# EAGLE design RoPE V3.0 Rev. 00 (EAGLE 9.4.2)
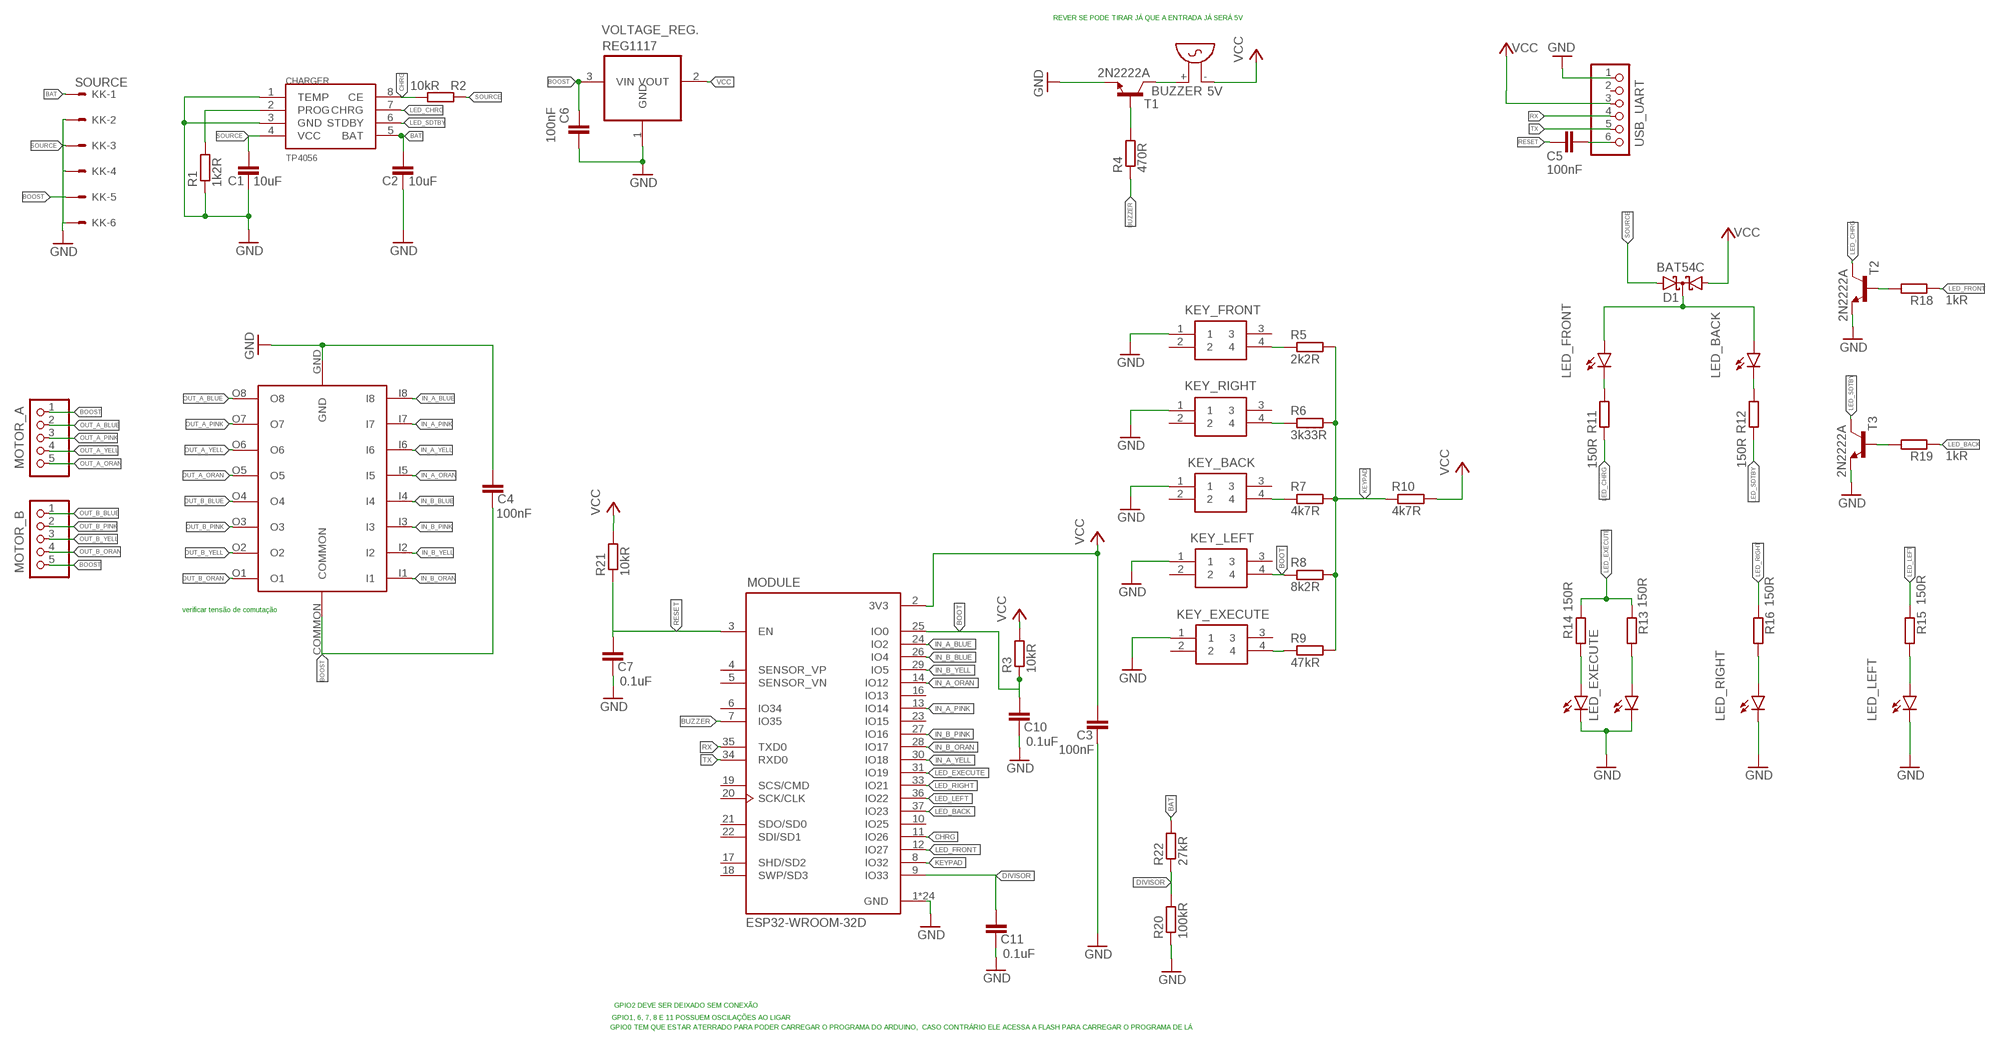
[diagram p0: schematic, sheet 1]

## Parts
BUZZER  5V  F/QMX  [F/QMX]
C1  10uF  C-EUC1210  [C1210]
C2  10uF  C-EUC1210  [C1210]
C3  100nF  C-EUC1210  [C1210]
C4  100nF  C-EUC1210  [C1210]
C5  100nF  C-EUC1210  [C1210]
C6  100nF  C-EUC1210  [C1210]
C7  0.1uF  C-EUC1210  [C1210]
C10  0.1uF  C-EUC1210  [C1210]
C11  0.1uF  C-EUC1210  [C1210]
CHARGER  TP4056  [SOP-8]
D1  BAT54C  [SOT23]
DRIVER  ULN2803AFWG  [ULN2803AFWG]
KEY_BACK  B3F-4050  [B3F-4000]
KEY_EXECUTE  B3F-4050  [B3F-4000]
KEY_FRONT  B3F-4050  [B3F-4000]
KEY_LEFT  B3F-4050  [B3F-4000]
KEY_RIGHT  B3F-4050  [B3F-4000]
KK  SOURCE  22-05-7068-06  [7395-06]
LED_BACK  ORANGE  LEDKA-3528ASYC  [KA-3528ASYC]
LED_EXECUTE  GREEN  LEDKA-3528ASYC  [KA-3528ASYC]
LED_EXECUTE2  GREEN  LEDKA-3528ASYC  [KA-3528ASYC]
LED_FRONT  BLUE  LEDKA-3528ASYC  [KA-3528ASYC]
LED_LEFT  RED  LEDKA-3528ASYC  [KA-3528ASYC]
LED_RIGHT  RED  LEDKA-3528ASYC  [KA-3528ASYC]
MODULE  ESP32-WROOM-32D  [MODULE_ESP32-WROOM-32D]
MOTOR_A  PINHD-1X5/90  [1X05/90]
MOTOR_B  PINHD-1X5/90  [1X05/90]
R1  1k2R  R-EU_R1206W  [R1206W]
R2  10kR  R-EU_R1206W  [R1206W]
R3  10kR  R-EU_R1206W  [R1206W]
R4  470R  R-EU_R1206W  [R1206W]
R5  2k2R  R-EU_R1206W  [R1206W]
R6  3k33R  R-EU_R1206W  [R1206W]
R7  4k7R  R-EU_R1206W  [R1206W]
R8  8k2R  R-EU_R1206W  [R1206W]
R9  47kR  R-EU_R1206W  [R1206W]
R10  4k7R  R-EU_R1206W  [R1206W]
R11  150R  R-EU_R1206W  [R1206W]
R12  150R  R-EU_R1206W  [R1206W]
R13  150R  R-EU_R1206W  [R1206W]
R14  150R  R-EU_R1206W  [R1206W]
R15  150R  R-EU_R1206W  [R1206W]
R16  150R  R-EU_R1206W  [R1206W]
R18  1kR  R-EU_R1206W  [R1206W]
R19  1kR  R-EU_R1206W  [R1206W]
R20  100kR  R-EU_R1206W  [R1206W]
R21  10kR  R-EU_R1206W  [R1206W]
R22  27kR  R-EU_R1206W  [R1206W]
T1  2N2222A  MMBT2222ALT1-NPN-SOT23-BEC  [SOT23-BEC]
T2  2N2222A  MMBT2222ALT1-NPN-SOT23-BEC  [SOT23-BEC]
T3  2N2222A  MMBT2222ALT1-NPN-SOT23-BEC  [SOT23-BEC]
USB_UART  PINHD-1X6/90  [1X06/90]
VOLTAGE_REG.  REG1117  [SOT223]

## Nets
BAT: C2.2 CHARGER.5(BAT) KK.1 R22.2
BOOST: C4.1 C6.2 DRIVER.COMMON KK.5 MOTOR_A.1 MOTOR_B.5 VOLTAGE_REG..3(VIN)
BOOT: C10.2 KEY_LEFT.4 MODULE.25(IO0) R3.1 R8.1
BUZZER: MODULE.7(IO35) R4.1
CHRG: CHARGER.8(CE) MODULE.11(IO26) R2.2
DIVISOR: C11.2 MODULE.9(IO33) R20.2 R22.1
GND: C1.1 C2.1 C3.1 C4.2 C6.1 C7.1 C10.1 C11.1 CHARGER.1(TEMP) CHARGER.3(GND) DRIVER.GND KEY_BACK.1 KEY_EXECUTE.1 KEY_FRONT.1 KEY_LEFT.1 KEY_RIGHT.1 KK.2 KK.4 KK.6 LED_EXECUTE2.C LED_EXECUTE.C LED_LEFT.C LED_RIGHT.C MODULE.1(GND) MODULE.15(GND) MODULE.38(GND) MODULE.39_1(GND) MODULE.39_2(GND) MODULE.39_3(GND) MODULE.39_4(GND) MODULE.39_5(GND) MODULE.39_6(GND) MODULE.39_7(GND) MODULE.39_8(GND) MODULE.39_9(GND) MODULE.39_10(GND) MODULE.39_11(GND) MODULE.39_12(GND) MODULE.39_13(GND) MODULE.39_14(GND) MODULE.39_15(GND) MODULE.39_16(GND) MODULE.39_17(GND) MODULE.39_18(GND) MODULE.39_19(GND) MODULE.39_20(GND) MODULE.39_21(GND) R1.1 R20.1 T1.E T2.E T3.E USB_UART.1 VOLTAGE_REG..1(GND)
IN_A_BLUE: DRIVER.I8 MODULE.24(IO2)
IN_A_ORAN: DRIVER.I5 MODULE.14(IO12)
IN_A_PINK: DRIVER.I7 MODULE.13(IO14)
IN_A_YELL: DRIVER.I6 MODULE.30(IO18)
IN_B_BLUE: DRIVER.I4 MODULE.26(IO4)
IN_B_ORAN: DRIVER.I1 MODULE.28(IO17)
IN_B_PINK: DRIVER.I3 MODULE.27(IO16)
IN_B_YELL: DRIVER.I2 MODULE.29(IO5)
KEYPAD: MODULE.8(IO32) R5.2 R6.2 R7.2 R8.2 R9.2 R10.1
LED_BACK: MODULE.37(IO23) R19.1
LED_CHRG: CHARGER.7(CHRG) R11.1 T2.C
LED_EXECUTE: MODULE.31(IO19) R13.1 R14.1
LED_FRONT: MODULE.12(IO27) R18.1
LED_LEFT: MODULE.36(IO22) R15.1
LED_RIGHT: MODULE.33(IO21) R16.1
LED_SDTBY: CHARGER.6(STDBY) R12.1 T3.C
N$4: C5.1 USB_UART.6
N$5: KEY_RIGHT.4 R6.1
N$6: LED_BACK.C R12.2
N$7: KEY_FRONT.4 R5.1
N$8: BUZZER.+ T1.C
N$9: R4.2 T1.B
N$10: LED_FRONT.C R11.2
N$12: LED_EXECUTE.A R13.2
N$13: LED_EXECUTE2.A R14.2
N$14: LED_RIGHT.A R16.2
N$15: LED_LEFT.A R15.2
N$16: CHARGER.2(PROG) R1.2
N$17: KEY_BACK.4 R7.1
N$18: R19.2 T3.B
N$19: R18.2 T2.B
N$20: D1.3(CC) LED_BACK.A LED_FRONT.A
N$22: KEY_EXECUTE.4 R9.1
OUT_A_BLUE: DRIVER.O8 MOTOR_A.2
OUT_A_ORAN: DRIVER.O5 MOTOR_A.5
OUT_A_PINK: DRIVER.O7 MOTOR_A.3
OUT_A_YELL: DRIVER.O6 MOTOR_A.4
OUT_B_BLUE: DRIVER.O4 MOTOR_B.1
OUT_B_ORAN: DRIVER.O1 MOTOR_B.4
OUT_B_PINK: DRIVER.O3 MOTOR_B.2
OUT_B_YELL: DRIVER.O2 MOTOR_B.3
RESET: C5.2 C7.2 MODULE.3(EN) R21.1
RX: MODULE.35(TXD0) USB_UART.4
SOURCE: C1.2 CHARGER.4(VCC) D1.2(A2) KK.3 R2.1
TX: MODULE.34(RXD0) USB_UART.5
VCC: BUZZER.- C3.2 D1.1(A1) MODULE.2(3V3) R3.2 R10.2 R21.2 USB_UART.3 VOLTAGE_REG..2(VOUT)
Unconnected: KEY_BACK.2 KEY_BACK.3 KEY_EXECUTE.2 KEY_EXECUTE.3 KEY_FRONT.2 KEY_FRONT.3 KEY_LEFT.2 KEY_LEFT.3 KEY_RIGHT.2 KEY_RIGHT.3 MODULE.4(SENSOR_VP) MODULE.5(SENSOR_VN) MODULE.6(IO34) MODULE.10(IO25) MODULE.16(IO13) MODULE.17(SHD/SD2) MODULE.18(SWP/SD3) MODULE.19(SCS/CMD) MODULE.20(SCK/CLK) MODULE.21(SDO/SD0) MODULE.22(SDI/SD1) MODULE.23(IO15) USB_UART.2

## Notes on the sheet
- REVER SE PODE TIRAR JÁ QUE A ENTRADA JÁ SERÁ 5V
- verificar tensão de comutação
- GPIO2 DEVE SER DEIXADO SEM CONEXÃO
- GPIO1, 6, 7, 8 E 11 POSSUEM OSCILAÇÕES AO LIGAR
- GPIO0 TEM QUE ESTAR ATERRADO PARA PODER CARREGAR O PROGRAMA DO ARDUINO,  CASO CONTRÁRIO ELE ACESSA A FLASH PARA CARREGAR O PROGRAMA DE LÁ

## Library data of the parts
BUZZER = buzzer:F/QMX: BUZZER Source: Buerklin; OC_FARNELL: unknown; OC_NEWARK: unknown
C1-C7 C10 C11 = rcl:C-EU: CAPACITOR, European symbol; SPICEPREFIX: C
CHARGER = TP4056:TP4056
D1 = diode:BAT54C: Schottky Diodes Source: Fairchild .. BAT54.pdf
DRIVER = ULN2803AFWG:ULN2803AFWG; AVAILABILITY: Unavailable; DESCRIPTION: Ic Darl Trans Array Hv 18-Sol - Uln2803afwg_o, El, m; MF: Toshiba Semiconductor; MP: ULN2803AFWG; PACKAGE: SOIC-18 Toshiba; PRICE: None
KEY_BACK KEY_EXECUTE KEY_FRONT KEY_LEFT KEY_RIGHT = B3F-4050:B3F-4050: lvory Plunger Tactile Switch, SPST-NO 0.05 A@ 24 V dc 3mm Source: Datasheet <https://www.omron.com/ecb/products/pdf/en-b3f.pdf>; DESCRIPTION: lvory Plunger Tactile Switch, SPST-NO 0.05 A@ 24 V dc 3mm; HEIGHT: mm; MANUFACTURER_NAME: Omron Electronics; MANUFACTURER_PART_NUMBER: B3F-4050; MOUSER_PART_NUMBER: 653-B3F-4050; MOUSER_PRICE-STOCK: https://www.mouser.com/Search/Refine.aspx?Keyword=653-B3F-4050; RS_PART_NUMBER: 6866768P; RS_PRICE-STOCK: http://uk.rs-online.com/web/p/products/6866768P
KK = EP_molex_6410_7395:22-?-06: CONNECTOR wire to board 2.54 mm (.1 inch) pitch header
LED_BACK LED_EXECUTE LED_EXECUTE2 LED_FRONT LED_LEFT LED_RIGHT = led:LED: LED OSRAM: - CHIPLED LG R971, LG N971, LY N971, LG Q971, LY Q971, LO R971, LY R971 LH N974, LH R974 LS Q976, LO Q976, LY Q976 LO Q996 - Hyper CHIPLED LW Q18S LB Q993, LB Q99A, LB R99A - SideLED LS A670, LO A670, LY A670, LG A670, LP A670 LB A673, LV A673, LT A673, LW A673 LH A674 LY A675 LS A676, LA A676, LO A676, LY A676, LW A676 LS A679, LY A679, LG A679 - Hyper Micro SIDELED® LS Y876, LA Y876, LO Y876, LY Y876 LT Y87S - SmartLED LW L88C, LW L88S LB L89C, LB L89S, LG L890 LS L89K, LO L89K, LY L89K LS L896, LA L896, LO L896, LY L896 - TOPLED LS T670, LO T670, LY T670, LG T670, LP T670 LSG T670, LSP T670, LSY T670, LOP T670, LYG T670 LG T671, LOG T671, LSG T671 LB T673, LV T673, LT T673, LW T673 LH T674 LS T676, LA T676, LO T676, LY T676, LB T676, LH T676, LSB T676, LW T676 LB T67C, LV T67C, LT T67C, LS T67K, LO T67K, LY T67K, LW E67C LS E67B, LA E67B, LO E67B, LY E67B, LB E67C, LV E67C, LT E67C LW T67C LS T679, LY T679, LG T679 LS T770, LO T770, LY T770, LG T770, LP T770 LB T773, LV T773, LT T773, LW T773 LH T774 LS E675, LA E675, LY E675, LS T675 LS T776, LA T776, LO T776, LY T776, LB T776 LHGB T686 LT T68C, LB T68C - Hyper Mini TOPLED® LB M676 - Mini TOPLED Santana® LG M470 LS M47K, LO M47K, LY M47K Source: http://www.osram.convergy.de LUXEON: - LUMILED® LXK2-PW12-R00, LXK2-PW12-S00, LXK2-PW14-U00, LXK2-PW14-V00 LXK2-PM12-R00, LXK2-PM12-S00, LXK2-PM14-U00 LXK2-PE12-Q00, LXK2-PE12-R00, LXK2-PE12-S00, LXK2-PE14-T00, LXK2-PE14-U00 LXK2-PB12-K00, LXK2-PB12-L00, LXK2-PB12-M00, LXK2-PB14-N00, LXK2-PB14-P00, LXK2-PB14-Q00 LXK2-PR12-L00, LXK2-PR12-M00, LXK2-PR14-Q00, LXK2-PR14-R00 LXK2-PD12-Q00, LXK2-PD12-R00, LXK2-PD12-S00 LXK2-PH12-R00, LXK2-PH12-S00 LXK2-PL12-P00, LXK2-PL12-Q00, LXK2-PL12-R00 Source: www.luxeon.com KINGBRIGHT: KA-3528ASYC Source: www.kingbright.com
MODULE = ESP32-WROOM-32D:ESP32-WROOM-32D: Bluetooth, WiFi 802.11b/g/n, Bluetooth v4.2 + EDR, Class 1, 2 and 3 Transceiver Module 2.4GHz ~ 2.5GHz Integrated, Trace Surface Mount Buy Part <https://snapeda.com/parts/ESP32-WROOM-32D/Espressif%20Systems/view-part/?ref=eda>; AVAILABILITY: Warning; DESCRIPTION: Bluetooth, WiFi 802.11b/g/n, Bluetooth v4.2 +EDR, Class 1, 2 and 3 Transceiver Module 2.4GHz ~ 2.5GHz Integrated, Trace Surface Mount; DIGIKEY-PURCHASE-URL: https://snapeda.com/shop?store=DigiKey&id=2768115; MF: Espressif Systems; MP: ESP32-WROOM-32D; PACKAGE: Module Espressif Systems; PRICE: None
MOTOR_A MOTOR_B = pinhead:PINHD-1X5: PIN HEADER
R1-R16 R18-R22 = rcl:R-EU_: RESISTOR, European symbol; SPICEPREFIX: R
T1-T3 = transistor:*-NPN-: NPN Transistror BF959 corrected 2008.03.06
USB_UART = pinhead:PINHD-1X6: PIN HEADER
VOLTAGE_REG. = burr-brown:REG1117: 800mA and 1A Low Dropout (LDO) Positive Regulator 1.8V, 2.5V, 2.85V, 3.3V, 5V, and Adj; MPN: REG1117; OC_FARNELL: 1097566; OC_NEWARK: 14P6981

## Board
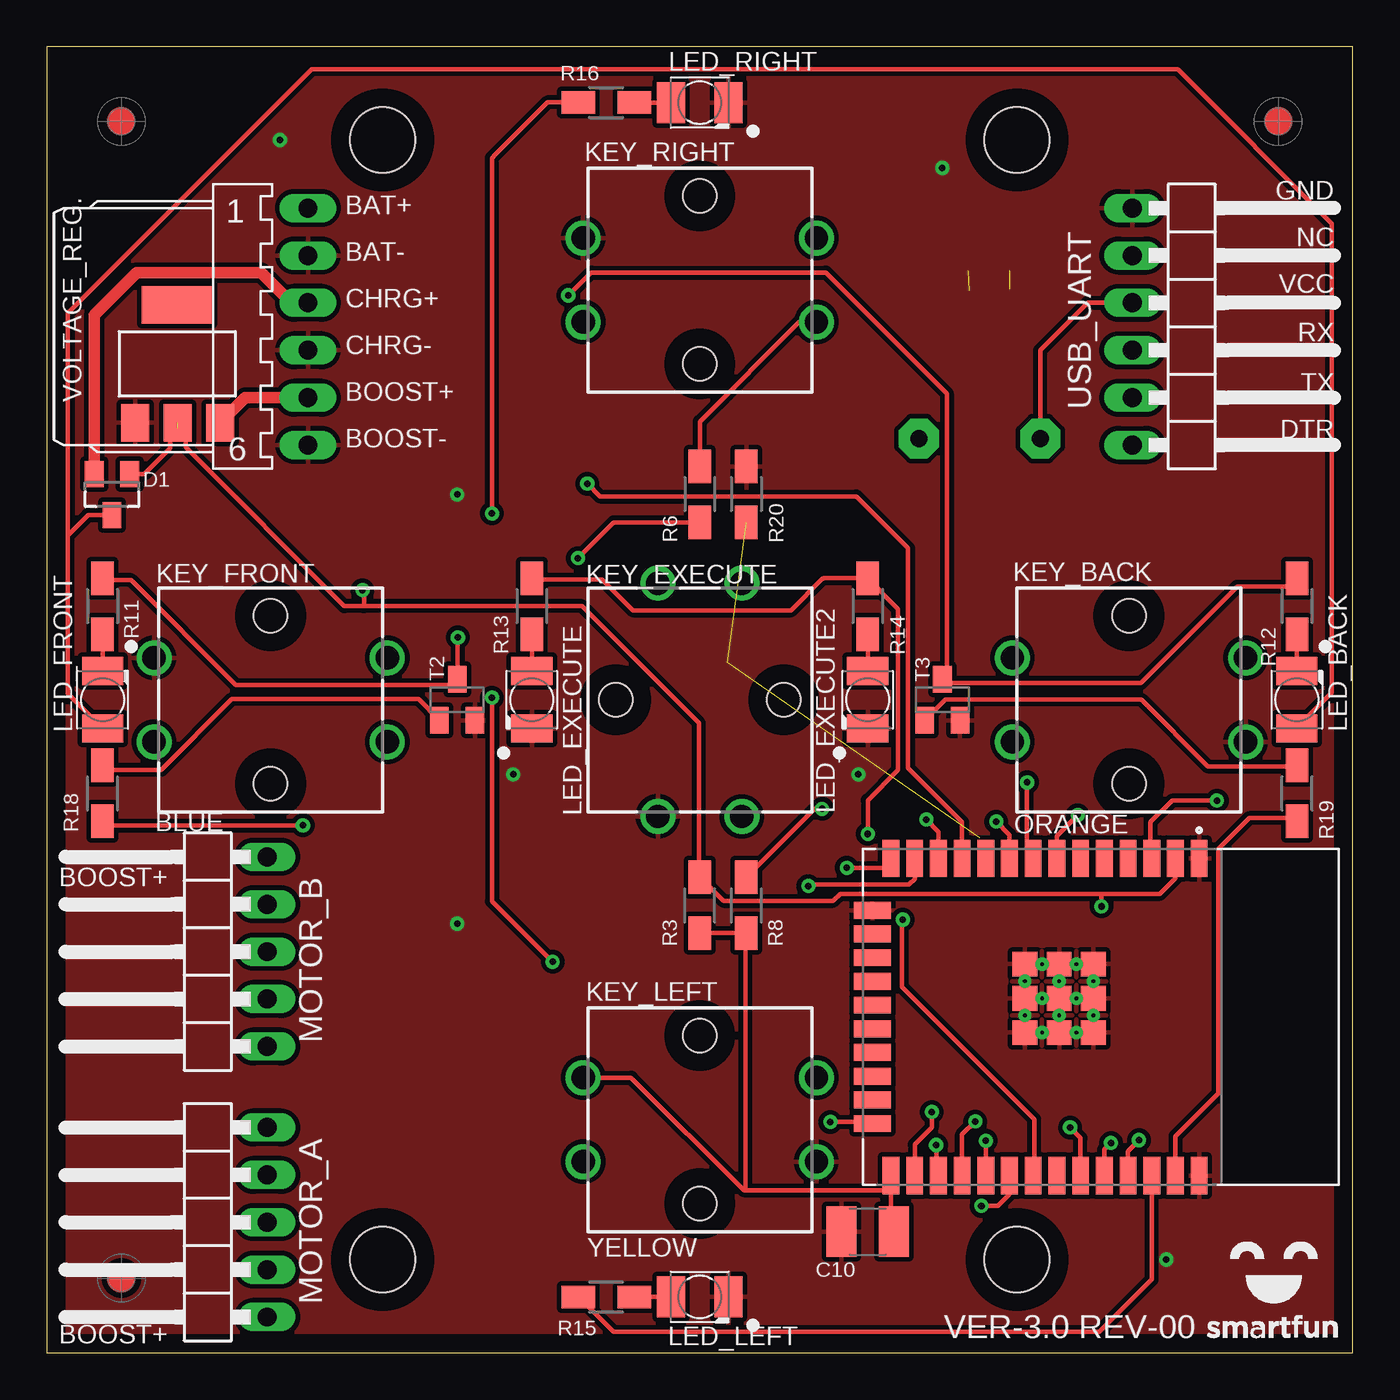
[diagram p1: board, top side]
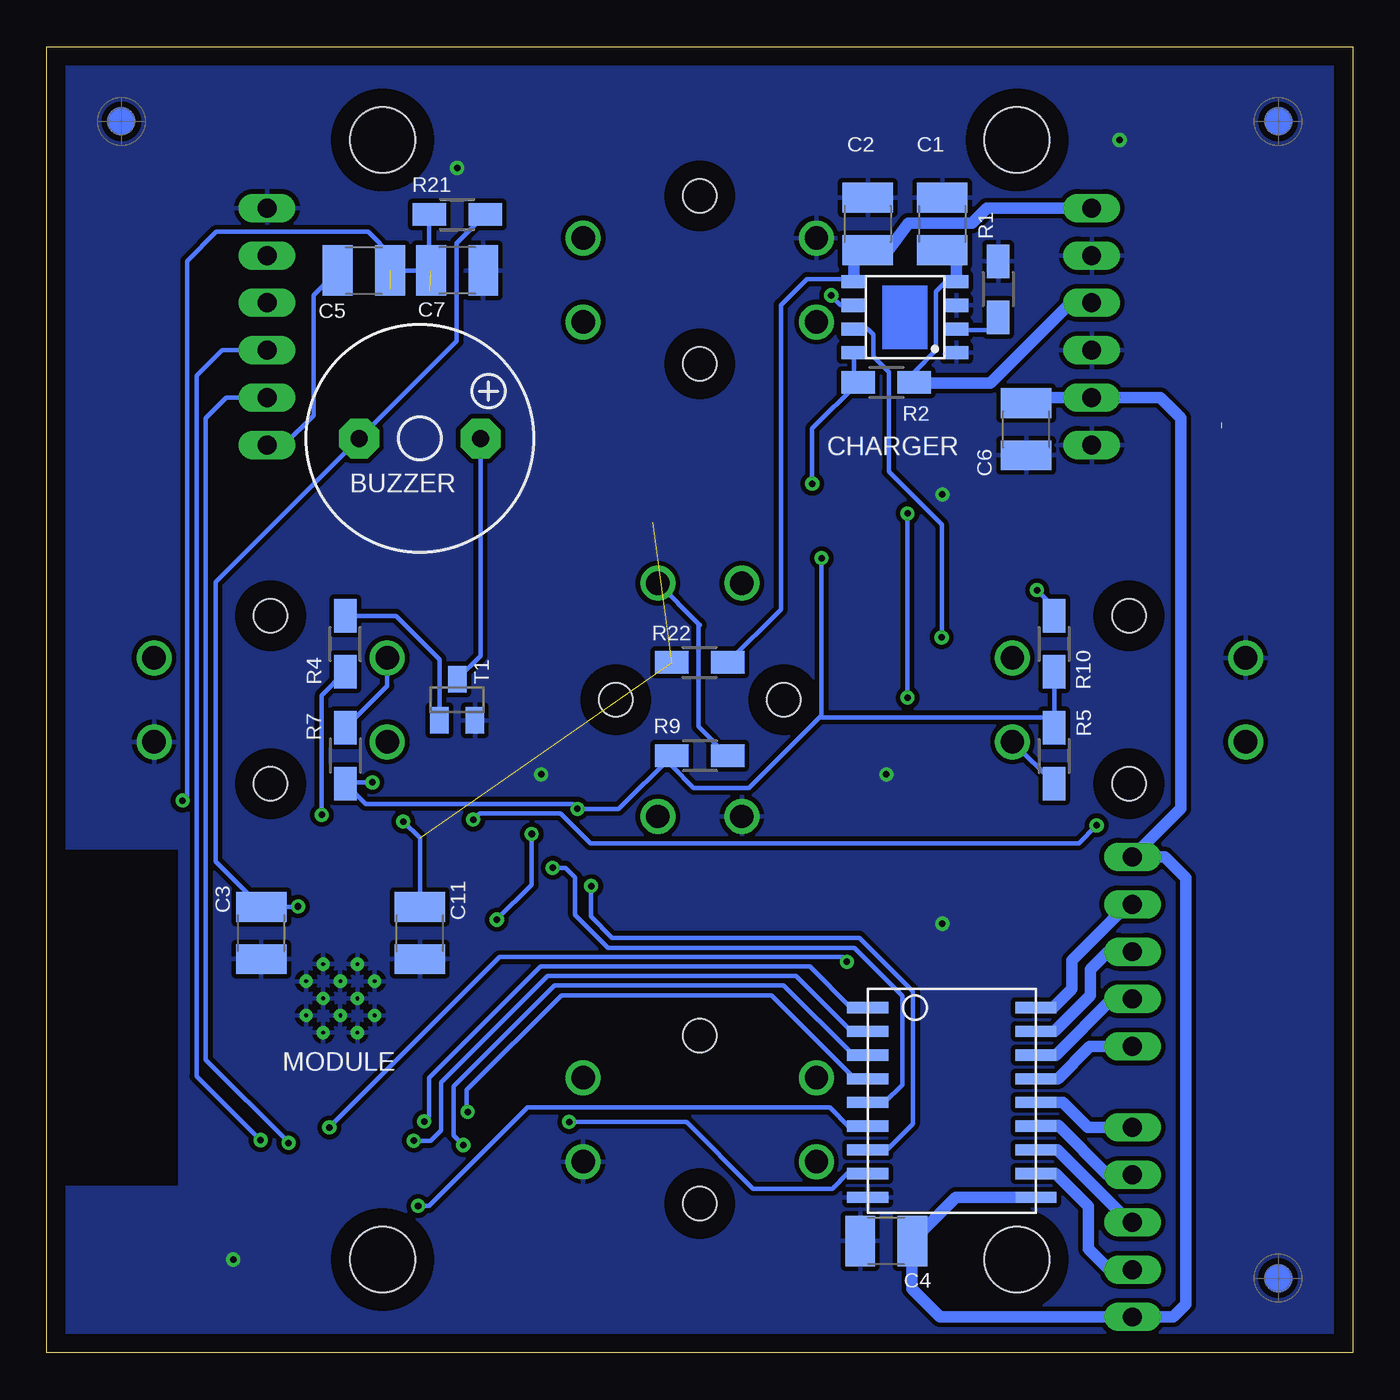
[diagram p2: board, bottom side, seen from below]

Size 70 x 70 mm. Coordinates in mm from the lower left corner, seen from the top.
Outline: 0,0 70,0 70,70 0,70 0,0
Copper layers (1*16): Top 0.035mm / dielectric 1.5mm / Bottom 0.035mm
Design rules "default *": minimum track width 0.25mm, minimum drill 0.35mm, track to track 0.25mm, track to pad 0.25mm, pad to pad 0.25mm, via to via 0.25mm, smd to smd 0.25mm, copper to edge 1mm, drill to drill 0.25mm, minimum pad ring 10mil, minimum via ring 8mil, stop-mask expansion 4mil, vias tented up to drill 0mil, thermal gap 10mil
Holes 3.5 mm at 52,65 18,65 52,5 18,5

### Footprints (pad centres in the part's own frame; a part is rotated, then mirrored left to right if it is on the bottom)
F/QMX = drill 0.914 pad 2.159 octagon: + 3.251,0; - -3.251,0
C1210 = smd 1.6 x 2.7: 1 -1.4,0; 2 1.4,0
SOP-8 = smd 1.3 x 0.7: 1 -2.75,1.905; 2 -2.75,0.635; 3 -2.75,-0.635; 4 -2.75,-1.905; 5 2.75,-1.905; 6 2.75,-0.635; 7 2.75,0.635; 8 2.75,1.905
SOT23 = smd 1 x 1.4: 1 -0.95,-1.1; 2 0.95,-1.1; 3 0,1.1
ULN2803AFWG = smd 0.6 x 2.2: COMMON 10.16,9.01; GND 10.16,0; I1 0,0; I2 1.27,0; I3 2.54,0; I4 3.81,0; I5 5.08,0; I6 6.35,0; I7 7.62,0; I8 8.89,0; O1 0,9.01; O2 1.27,9.01; O3 2.54,9.01; O4 3.81,9.01; O5 5.08,9.01; O6 6.35,9.01; O7 7.62,9.01; O8 8.89,9.01
B3F-4000 = drill 1.25 pad 1.85: 1 6.25,-2.25; 2 -6.25,-2.25; 3 6.25,2.25; 4 -6.25,2.25 | hole 1.8: 0,4.5; 0,-4.5
7395-06 = drill 1.016 long: 1 6.35,0; 2 3.81,0; 3 1.27,0; 4 -1.27,0; 5 -3.81,0; 6 -6.35,0
KA-3528ASYC = smd 1.5 x 2.2: A -1.55,0; C 1.55,0
MODULE_ESP32-WROOM-32D = smd 2 x 0.9: 1 -8.5,5.26; 2 -8.5,3.99; 3 -8.5,2.72; 4 -8.5,1.45; 5 -8.5,0.18; 6 -8.5,-1.09; 7 -8.5,-2.36; 8 -8.5,-3.63; 9 -8.5,-4.9; 10 -8.5,-6.17; 11 -8.5,-7.44; 12 -8.5,-8.71; 13 -8.5,-9.98; 14 -8.5,-11.25; 25 8.5,-11.25; 26 8.5,-9.98; 27 8.5,-8.71; 28 8.5,-7.44; 29 8.5,-6.17; 30 8.5,-4.9; 31 8.5,-3.63; 32 8.5,-2.36; 33 8.5,-1.09; 34 8.5,0.18; 35 8.5,1.45; 36 8.5,2.72; 37 8.5,3.99; 38 8.5,5.26 | smd 0.9 x 2: 15 -5.715,-12.25; 16 -4.445,-12.25; 17 -3.175,-12.25; 18 -1.905,-12.25; 19 -0.635,-12.25; 20 0.635,-12.25; 21 1.905,-12.25; 22 3.175,-12.25; 23 4.445,-12.25; 24 5.715,-12.25 | smd 1.33 x 1.33: 39_1 -2.835,-0.405; 39_2 -1,-0.405; 39_3 0.835,-0.405; 39_4 -2.835,-2.24; 39_5 -1,-2.24; 39_6 0.835,-2.24; 39_7 -2.835,-4.075; 39_8 -1,-4.075; 39_9 0.835,-4.075 | drill 0.2 pad 0.3: 39_10 -1.917,-0.405; 39_11 -0.083,-0.405; 39_12 -2.835,-1.323; 39_13 -1,-1.323; 39_14 0.835,-1.323; 39_15 -1.917,-2.24; 39_16 -0.083,-2.24; 39_17 -2.835,-3.158; 39_18 -1,-3.158; 39_19 0.835,-3.158; 39_20 -1.917,-4.075; 39_21 -0.083,-4.075
1X05/90 = drill 1.016 long: 1 -5.08,-3.81; 2 -2.54,-3.81; 3 0,-3.81; 4 2.54,-3.81; 5 5.08,-3.81
R1206W = smd 1.8 x 1.2: 1 -1.499,0; 2 1.499,0
SOT23-BEC = smd 1 x 1.4: B -0.95,-1.1; C 0,1.1; E 0.95,-1.1
1X06/90 = drill 1.016 long: 1 -6.35,-3.81; 2 -3.81,-3.81; 3 -1.27,-3.81; 4 1.27,-3.81; 5 3.81,-3.81; 6 6.35,-3.81
SOT223 = smd 1.499 x 2.007: 1 -2.261,-3.15; 2 0.025,-3.15; 3 2.311,-3.15 | smd 3.81 x 2.007: 4 0,3.15

### Placement (x,y rotation side)
BUZZER  50,49 0 bottom
C1  22,60.5 270 bottom
C2  26,60.5 270 bottom
C3  58.5,22.5 90 bottom
C4  25,6 180 bottom
C5  53,58 0 bottom
C6  17.5,49.5 90 bottom
C7  48,58 180 bottom
C10  44,6.5 0 top
C11  50,22.5 90 bottom
CHARGER  24,55.5 180 bottom
D1  3.5,46 180 top
DRIVER  26,18.5 270 bottom
KEY_BACK  58,35 0 top
KEY_EXECUTE  35,35 270 top
KEY_FRONT  12,35 180 top
KEY_LEFT  35,12.5 0 top
KEY_RIGHT  35,57.5 180 top
KK  14,55 90 top
LED_BACK  67,35 90 top
LED_EXECUTE  26,35 270 top
LED_EXECUTE2  44,35 270 top
LED_FRONT  3,35 90 top
LED_LEFT  35,3 0 top
LED_RIGHT  35,67 0 top
MODULE  56.5,18 270 top
MOTOR_A  8,7 90 top
MOTOR_B  8,21.5 90 top
R1  19,57 270 bottom
R2  25,52 180 bottom
R3  35,24 90 top
R4  54,38 90 bottom
R5  16,32 90 bottom
R6  35,46 270 top
R7  54,32 270 bottom
R8  37.5,24 90 top
R9  35,32 180 bottom
R10  16,38 90 bottom
R11  3,40 270 top
R12  67,40 270 top
R13  26,40 270 top
R14  44,40 270 top
R15  30,3 0 top
R16  30,67 0 top
R18  3,30 90 top
R19  67,30 90 top
R20  37.5,46 270 top
R21  48,61 0 bottom
R22  35,37 0 bottom
T1  48,35 0 bottom
T2  22,35 0 top
T3  48,35 0 top
U$1  [FIDUCIAL_G15]  66,66 0 top
U$2  [FIDUCIAL_G15]  4,4 0 top
U$3  [FIDUCIAL_G15]  4,66 0 top
U$4  [FIDUCIAL_G15]  4,4 0 bottom
U$5  [FIDUCIAL_G15]  4,66 0 bottom
U$6  [FIDUCIAL_G15]  66,66 0 bottom
USB_UART  62,55 270 top
VOLTAGE_REG.  7,53 0 top

### Tracks (layer width: path | path; a pad name or v marks a point on that pad's centre or on a via)
BAT
  Bottom 0.25: 26.77,58.98 26.12,58.98 C2.2 | R22.2 30.66,39.84 30.66,56.15 29.25,57.55 26.9,57.55 CHARGER.5
  Bottom 0.607: CHARGER.5 26.75,58.85 C2.2 24.88,59.1 23.81,60.54 20.41,60.54
  Bottom 0.61: KK.1 19.6,61.35 20.41,60.54
BOOST
  Top 0.61: KK.5 10.65,51.19 VOLTAGE_REG..3
  Bottom 0.607: 8.95,2.6 8.95,25.46 10.07,26.58 MOTOR_B.5 10.9,26.58
  Bottom 0.61: 8.95,2.6 9.63,1.92 MOTOR_A.1 22.12,1.92 23.63,3.43 23.63,5.97 C4.1 21.26,8.34 DRIVER.COMMON | C6.2 17.21,51.19 KK.5 10.31,51.19 9.21,50.09 9.21,29.18 MOTOR_B.5
BOOT
  Top 0.25: 45.4,9.35 MODULE.25 45.25,8.83 | R3.1 37.24,22.5 | 37.24,22.5 R8.1 | 45.25,8.71 | 45.25,8.71 45.25,8.83 | 45.25,8.71 45.25,6.65 C10.2 | 37.45,8.71 37.36,8.71 31.33,14.75 KEY_LEFT.4 | 37.45,8.71 45.13,8.71 45.25,8.83 | 37.45,8.71 37.45,22.29 37.24,22.5
BUZZER  (via drill 0.35)
  Top 0.25: 53.99,26.65 MODULE.7 54.14,27.7 v55.26,28.83
  Bottom 0.25: v55.26,28.83 55.26,35.24 R4.1
CHRG  (via drill 0.35)
  Top 0.25: MODULE.11 | MODULE.11 49.03,26.53 | v28.98,46.58 29.65,45.9 43.39,45.9 46.16,43.12 46.16,31.34 49.06,28.44 | 49.06,28.44 | 49.06,28.44 MODULE.11
  Bottom 0.25: 26.75,53.25 CHARGER.8 26.75,52.25 R2.2 28.98,49.52 v28.98,46.58
DIVISOR  (via drill 0.35)  (2 unrouted)
  Top 0.25: 51.92,26.18 MODULE.9 51.6,27.76 v50.89,28.47
  Bottom 0.25: C11.2 50,27.58 v50.89,28.47
GND  (via drill 0.35)
  Bottom 0.25: CHARGER.3 21.51,56.13 | 21.55,53.59 CHARGER.1 | 26.58,5.82 C4.2
  other vias: 12.5,65 22,46 22,23 60,5 48,63.5 25,31 43.5,31
  pour Top: 0,0 69.97,0 70,0.03 70,69.97 0,69.97
  pour Bottom: 0,0 70,0 70,8.89 62.88,8.89 62.88,27.03 70,27.03 70,70 0,70
IN_A_BLUE  (via drill 0.35)
  Top 0.25: MODULE.24 44.16,12.38 v42,12.38
  Bottom 0.25: v42,12.38 35.71,12.38 32.13,8.8 27.88,8.8 27.07,9.61 DRIVER.I8
IN_A_ORAN  (via drill 0.35)
  Top 0.25: MODULE.14 45.18,26.05 | 45.18,26.05 45.15,25.9 | v42.89,25.99 45.12,25.99 45.18,26.05
  Bottom 0.25: v42.89,25.99 42.88,26 42.19,26 41.67,25.49 41.67,23.48 39.9,21.71 26.72,21.71 24.14,19.13 24.14,14.37 25.09,13.42 DRIVER.I5
IN_A_PINK  (via drill 0.35)
  Top 0.25: 46.52,25.78 MODULE.13 46.52,25.4 46.22,25.1 40.91,25.1 v40.82,25.02
  Bottom 0.25: DRIVER.I7 25.9,10.78 25.08,10.78 23.58,12.28 23.58,19.37 26.45,22.24 39.7,22.24 40.83,23.38 40.83,25 v40.82,25.02
IN_A_YELL  (via drill 0.35)
  Top 0.25: MODULE.30 51.6,8.51 50.97,7.88 50.81,7.88 50.81,7.87 v50.09,7.87
  Bottom 0.25: v50.09,7.87 49.52,7.87 44.24,13.15 28.03,13.15 27.03,12.15 DRIVER.I6
IN_B_BLUE  (via drill 0.35)
  Top 0.25: v47.44,12.91 47.44,12.08 46.52,11.16 MODULE.26
  Bottom 0.25: v47.44,12.91 47.49,12.97 47.49,14.09 42.41,19.17 31.16,19.17 26.68,14.69 DRIVER.I4
IN_B_ORAN  (via drill 0.35)
  Top 0.25: MODULE.28 49.06,11.7 v49.77,12.4
  Bottom 0.25: 49.5,13.14 49.5,14.74 43.53,20.71 29.09,20.71 26.89,18.5 DRIVER.I1 | 49.5,13.14 | 49.5,13.14 49.5,12.67 v49.77,12.4
IN_B_PINK  (via drill 0.35)
  Top 0.25: 47.7,11.13 v47.67,11.13 47.67,9.12 MODULE.27
  Bottom 0.25: v47.67,11.13 48.2,11.67 48.2,14.29 42.79,19.7 30.52,19.7 26.77,15.96 DRIVER.I3
IN_B_YELL  (via drill 0.35)
  Top 0.25: 50.33,10.21 MODULE.29 v50.33,11.37
  Bottom 0.25: v50.33,11.37 49.41,11.37 48.85,11.94 48.85,14.5 43.15,20.21 29.84,20.21 26.86,17.23 DRIVER.I2
KEYPAD  (via drill 0.35)
  Top 0.25: R8.2 41.15,29.15 v41.56,29.15 | v52.55,30.57 52.55,26.82 MODULE.8 | v28.47,42.59 30.38,44.5 R6.2
  Bottom 0.25: R10.1 R5.2 16.56,34.06 28.57,34.06 | v52.55,30.57 53.93,30.57 R7.2 52.92,29.42 41.82,29.42 v41.56,29.15 39.35,29.15 R9.2 36.5,31.45 35.33,30.27 32.36,30.27 28.57,34.06 | 28.57,34.06 28.48,34.16 28.48,39.16 | 28.48,39.61 28.48,39.16 | v28.47,42.59 28.47,39.17 28.48,39.16
LED_BACK
  Top 0.25: R19.1 66.85,28.65 64.45,28.65 62.79,27 62.79,13.91 60.49,11.61 MODULE.37
LED_CHRG  (via drill 0.35)
  Top 0.25: v22.03,38.34 22.03,36.13 T2.C 21.69,35.79 10.14,35.79 4.52,41.41 3.09,41.41 R11.1
  Bottom 0.25: CHARGER.7 25.98,54.87 25.69,54.58 25.69,53.38 24.87,52.55 24.87,47.23 22.03,44.4 v22.03,38.34
LED_EXECUTE  (via drill 0.35)
  Top 0.25: R13.1 26.06,41.44 29.77,41.44 31.43,39.79 39.88,39.79 41.59,41.5 41.62,41.5 41.62,41.53 43.97,41.53 R14.1 45.63,39.87 45.63,31.23 44.01,29.61 v44.01,27.81 | MODULE.31 52.93,9.56 52.93,12.52 45.84,19.61 45.84,23.18 v45.88,23.21
  Bottom 0.25: v45.88,23.21 44.01,25.09 v44.01,27.81
LED_FRONT  (via drill 0.35)
  Top 0.25: R18.1 3.01,28.5 3.25,28.27 v13.73,28.27 | MODULE.12 47.79,27.93 v47.14,28.58
  Bottom 0.25: v13.73,28.27 14.69,27.31 40.86,27.31 42.47,28.92 46.8,28.92 v47.14,28.58
LED_LEFT
  Top 0.25: R15.1 30.38,1.12 56.41,1.12 59.22,3.93 MODULE.36
LED_RIGHT  (via drill 0.35)
  Top 0.25: 55.28,9.63 MODULE.33 55.41,11.52 v54.85,12.08 | R16.1 28.48,67.02 26.85,67.02 24.04,64.21 23.86,64.03 v23.86,44.98 | v23.86,35.12 23.86,24.2 v27.11,20.96
  Bottom 0.25: v54.85,12.08 45.72,21.21 27.36,21.21 v27.11,20.96 | v23.86,35.12 v23.86,44.98
LED_SDTBY  (via drill 0.35)
  Top 0.25: 66.56,41.05 R12.1 67.17,41.33 67.17,40.88 66.99,41.05 63.8,41.05 58.63,35.89 48.21,35.89 T3.C 48.24,36.34 48.24,51.42 41.76,57.89 29.18,57.89 v27.95,56.67
  Bottom 0.25: 26.2,56.03 26.3,56.13 CHARGER.6 27.45,56.13 27.95,56.64 v27.95,56.67
N$4
  Bottom 0.25: 54.4,56.92 C5.1 55.7,56.7 55.7,55.7 55.7,55.35 55.7,50.24 57.3,48.65 USB_UART.6
N$5
  Top 0.25: KEY_RIGHT.4 41.24,55.26 40.35,55.26 35,49.92 R6.1
N$6
  Top 0.25: R12.2 LED_BACK.C
N$7
  Bottom 0.25: R5.1 KEY_FRONT.4
N$8
  Bottom 0.25: T1.C 46.75,37.35 BUZZER.+
N$9
  Bottom 0.25: 53.9,39.4 | 53.9,39.4 R4.2 | T1.B 48.95,37.16 51.27,39.49 53.81,39.49 53.9,39.4
N$10
  Top 0.25: R11.2 LED_FRONT.C
N$12
  Top 0.25: R13.2 LED_EXECUTE.A
N$13
  Top 0.25: R14.2 LED_EXECUTE2.A
N$14
  Top 0.25: LED_RIGHT.A R16.2
N$15
  Top 0.25: R15.2 LED_LEFT.A
N$16
  Bottom 0.25: R1.2 19.18,54.82 21.2,54.82
  Bottom 0.607: 21.2,54.82 CHARGER.2
N$17
  Bottom 0.25: KEY_BACK.4 51.75,35.75 R7.1
N$18
  Top 0.25: R19.2 66.94,31.44 62.22,31.44 58.65,35.01 48.16,35.01 T3.B
N$19
  Top 0.25: 20.73,34.23 T2.B 19.92,35.03 9.92,35.03 6.14,31.25 3.25,31.25 | 3.25,31.25 | 3.25,31.25 R18.2
N$20
  Top 0.25: LED_FRONT.A 1.12,35.33 1.12,43.8 | 1.12,43.8 2.22,44.9 D1.3 | 1.12,43.8 1.12,55.71 14.2,68.79 60.61,68.79 68.88,60.52 68.88,35.38 67,33.51 LED_BACK.A 67,34.03
N$22
  Bottom 0.25: 35,39 35.06,39.06 | KEY_EXECUTE.4 35.1,39.1 35.06,39.06 | R9.1 35.06,33.56 35.06,39.06
OUT_A_BLUE
  Bottom 0.61: DRIVER.O8 15.93,9.61 14.18,7.86 14.18,5.58 13.05,4.46 MOTOR_A.2
OUT_A_ORAN
  Bottom 0.61: DRIVER.O5 15.55,13.42 14.21,12.08 MOTOR_A.5
OUT_A_PINK
  Bottom 0.61: MOTOR_A.3 11.96,7 15.84,10.88 DRIVER.O7
OUT_A_YELL
  Bottom 0.61: 12.94,9.54 MOTOR_A.4 13.14,9.54 15.78,12.18 16.96,12.18 DRIVER.O6
OUT_B_BLUE
  Bottom 0.61: MOTOR_B.1 14.09,16.42 15.82,14.69 DRIVER.O4
OUT_B_ORAN
  Bottom 0.61: DRIVER.O1 16.07,18.5 15.06,19.51 15.06,21.03 12.05,24.04 MOTOR_B.4
OUT_B_PINK
  Bottom 0.61: MOTOR_B.2 12.91,18.96 15.92,15.95 17.57,15.95 17.56,15.96 DRIVER.O3
OUT_B_YELL
  Bottom 0.61: DRIVER.O2 16,17.23 14.06,19.17 14.06,20.56 13.12,21.5 MOTOR_B.3
RESET  (via drill 0.35)  (2 unrouted)
  Top 0.25: MODULE.3 59.16,26.56 59.16,28.44 60.31,29.59 v62.72,29.59
  Bottom 0.25: 49.45,56.91 49.53,56.84 | 51.6,57 | v62.72,29.59 62.47,29.84 62.47,58.51 60.9,60.08 52.78,60.08 51.48,58.78 51.48,58 | 51.48,58 C7.2 49.5,58.1 R21.1 | 51.48,58 C5.2
RX  (via drill 0.35)
  Top 0.25: v58.54,11.4 57.95,10.81 MODULE.35
  Bottom 0.25: v58.54,11.4 61.96,14.82 61.96,49.12 61.96,49.3 61.96,52.37 60.6,53.73 USB_UART.4
SOURCE
  Top 0.607: 11.49,57.89 4.83,57.89 2.57,55.63
  Top 0.61: KK.3 13.11,56.27 11.49,57.89 | 2.57,55.63 2.55,55.61 D1.2
  Bottom 0.25: CHARGER.4 21.81,57.41 22.34,56.88 22.34,53.73 23.5,52.57 R2.1
  Bottom 0.607: C1.2 21.25,58.85 CHARGER.4
  Bottom 0.61: KK.3 15.12,56.27 19.42,51.97 23.47,51.97 R2.1
TX  (via drill 0.35)
  Top 0.25: MODULE.34 56.68,10.9 v57.03,11.25
  Bottom 0.25: v57.03,11.25 57.03,11.28 61.46,15.71 61.46,47.61 61.46,47.92 61.46,50.09 60.37,51.19 USB_UART.5
VCC  (via drill 0.35)  (1 unrouted)
  Top 0.25: 60.52,26.29 60.49,26.26 MODULE.2 60.49,25.43 59.66,24.6 56.53,24.6 | 53.22,49.03 BUZZER.- 53.25,53.72 55.8,56.27 USB_UART.3 | 56.53,24.6 42.53,24.6 42.15,24.22 36.28,24.22 R3.2 34.96,25.5 34.96,33.74 28.68,40.02 17.01,40.02 | v56.53,23.92 56.53,24.6 | 17.01,40.02 15.95,40.02 7.44,48.53 7.44,49.43 VOLTAGE_REG..2 | v16.92,40.88 17.01,40.79 17.01,40.02 | D1.1 5.22,47.1 6.61,48.49 6.61,49.14 7.03,49.55
  Bottom 0.25: C3.2 56.56,23.9 v56.53,23.92 | C3.2 59.38,23.9 | C3.2 60.93,26.33 60.93,41.32 BUZZER.- 48.03,54.23 48.03,58.39 48.03,58.48 48.03,59.48 R21.2 | R10.2 16,39.95 v16.92,40.88

### Text on the board
tNames: GND | BAT+ | NC | BAT- | VCC | CHRG+ | RX | CHRG- | TX | BOOST+ | DTR | BOOST- | BLUE | ORANGE | BOOST+ | YELLOW | BOOST+ | VER-3.0 REV-00